# EAGLE design Instrumentation amp (EAGLE 6.6.0)
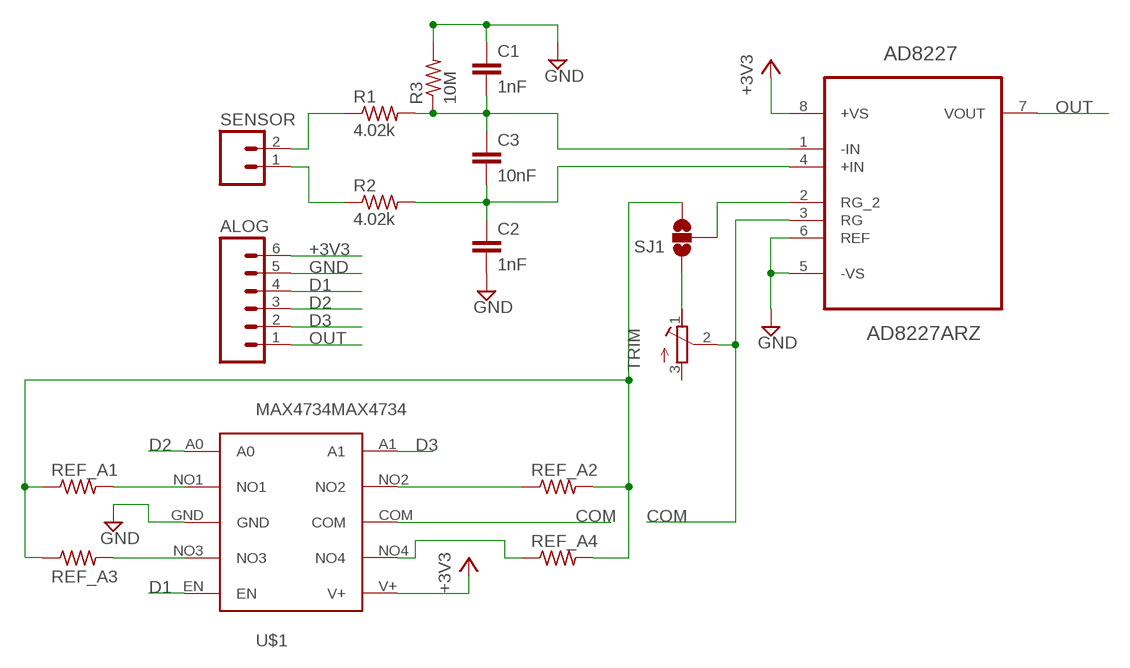
[diagram p0: schematic, sheet 1]

## Parts
AD8227  AD8227ARZ  [SOIC127P600X175-8N]
ALOG  M063.5MM-6  [SCREWTERMINAL-3.5MM-6]
C1  1nF  C-EUC0805  [C0805]
C2  1nF  C-EUC0805  [C0805]
C3  10nF  C-EUC0805  [C0805]
R1  4.02k  R-US_M0805  [M0805]
R2  4.02k  R-US_M0805  [M0805]
R3  10M  R-US_M0805  [M0805]
REF_A1  R-US_0207/10  [0207/10]
REF_A2  R-US_0207/10  [0207/10]
REF_A3  R-US_0207/10  [0207/10]
REF_A4  R-US_0207/10  [0207/10]
SENSOR  M023.5MM  [SCREWTERMINAL-3.5MM-2]
SJ1  SOLDERJUMPER_2WAYS  [SJ_3]
TRIM  R-TRIMM3006P  [RTRIM3006P]
U$1  MAX4734MAX4734  [UMAX-10]

## Nets
+3V3: AD8227.8(+VS) ALOG.6 U$1.V+
COM: AD8227.3(RG) TRIM.2(S) U$1.COM
D1: ALOG.4 U$1.EN
D2: ALOG.3 U$1.A0
D3: ALOG.2 U$1.A1
GND: AD8227.5(-VS) AD8227.6(REF) ALOG.5 C1.1 C2.2 R3.2 U$1.GND
N$1: AD8227.1(-IN) C1.2 C3.1 R1.2 R3.1
N$2: AD8227.4(+IN) C2.1 C3.2 R2.2
N$4: REF_A1.2 U$1.NO1
N$5: REF_A3.2 U$1.NO3
N$6: REF_A2.1 U$1.NO2
N$8: R1.1 SENSOR.2
N$9: REF_A4.1 U$1.NO4
N$10: R2.1 SENSOR.1
N$11: REF_A1.1 REF_A2.2 REF_A3.1 REF_A4.2 SJ1.3
N$12: SJ1.1 TRIM.1(A)
N$13: AD8227.2(RG_2) SJ1.2
OUT: AD8227.7(VOUT) ALOG.1
Unconnected: TRIM.3(E)

## Library data of the parts
AD8227 = Analog_devices_element14_Batch_1:AD8227ARZ: Rail-to-Rail Output Instrumentation Amplifier; MPN: AD8227ARZ; OC_FARNELL: 1827395; OC_NEWARK: 80R8171; PACKAGE: SOIC-8; SUPPLIER: Analog Devices
ALOG = SparkFun-Connectors:M06: Header 6 Standard 6-pin 0.1" header. Use with straight break away headers (SKU : PRT-00116), right angle break away headers (PRT-00553), swiss pins (PRT-00743), machine pins (PRT-00117), and female headers (PRT-00115). Molex polarized connector foot print use with SKU : PRT-08094 with associated crimp pins and housings. NOTES ON THE VARIANTS LOCK and LOCK_LONGPADS... This footprint was designed to help hold the alignment of a through-hole component (i.e. 6-pin header) while soldering it into place. You may notice that each hole has been shifted either up or down by 0.005 of an inch from it's more standard position (which is a perfectly straight line). This slight alteration caused the pins (the squares in the middle) to touch the edges of the holes. Because they are alternating, it causes a "brace" to hold the component in place. 0.005 has proven to be the perfect amount of "off-center" position when using our standard breakaway headers. Although looks a little odd when you look at the bare footprint, once you have a header in there, the alteration is very hard to notice. Also,if you push a header all the way into place, it is covered up entirely on the bottom side. This idea of altering the position of holes to aid alignment will be further integrated into the Sparkfun Library for other footprints. It can help hold any component with 3 or more connection pins.
C1-C3 = rcl:C-EU: CAPACITOR, European symbol
R1-R3 = rcl:R-US_: RESISTOR, American symbol
REF_A1-REF_A4 = resistor:R-US_: RESISTOR, American symbol
SENSOR = SparkFun-Connectors:M02: Standard 2-pin 0.1" header. Use with - straight break away headers ( PRT-00116) - right angle break away headers (PRT-00553) - swiss pins (PRT-00743) - machine pins (PRT-00117) - female headers (PRT-00115) Molex polarized connector foot print use with: PRT-08233 with associated crimp pins and housings. 2.54_SCREWTERM for use with PRT-10571. 3.5mm Screw Terminal footprints for PRT-08084 5mm Screw Terminal footprints for use with PRT-08432; PROD_ID: CONN-08399
SJ1 = SparkFun-Retired:SOLDERJUMPER_2WAY: Solder Jumper 2 way solder jumper
TRIM = resistor:R-TRIMM: Trimm resistor
U$1 = csandell:MAX4734

## Net classes
0 default: width 0.203 mm, drill 0.305 mm

## Board
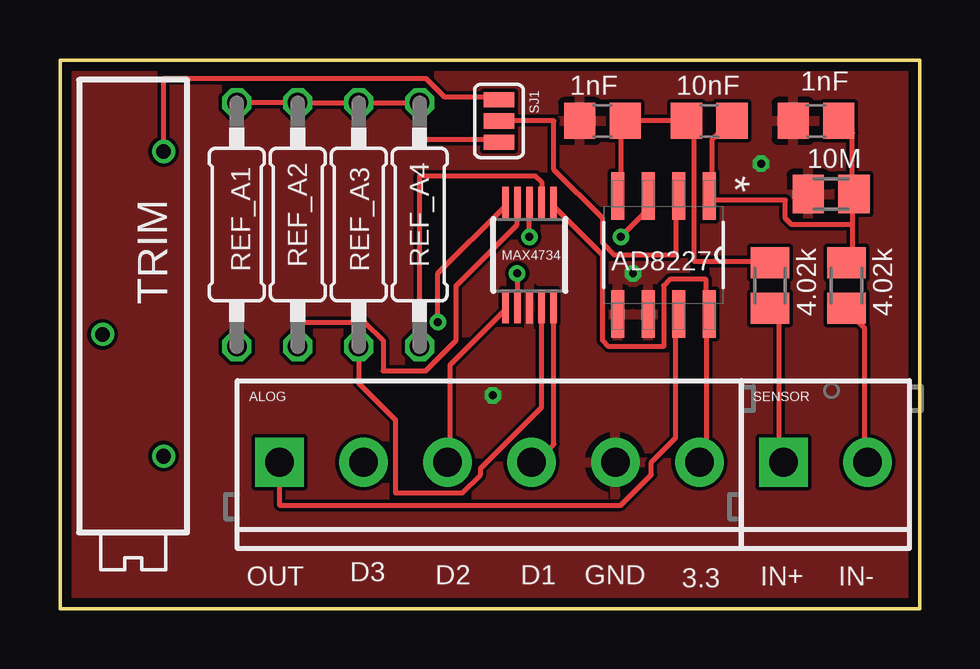
[diagram p1: board, top side]
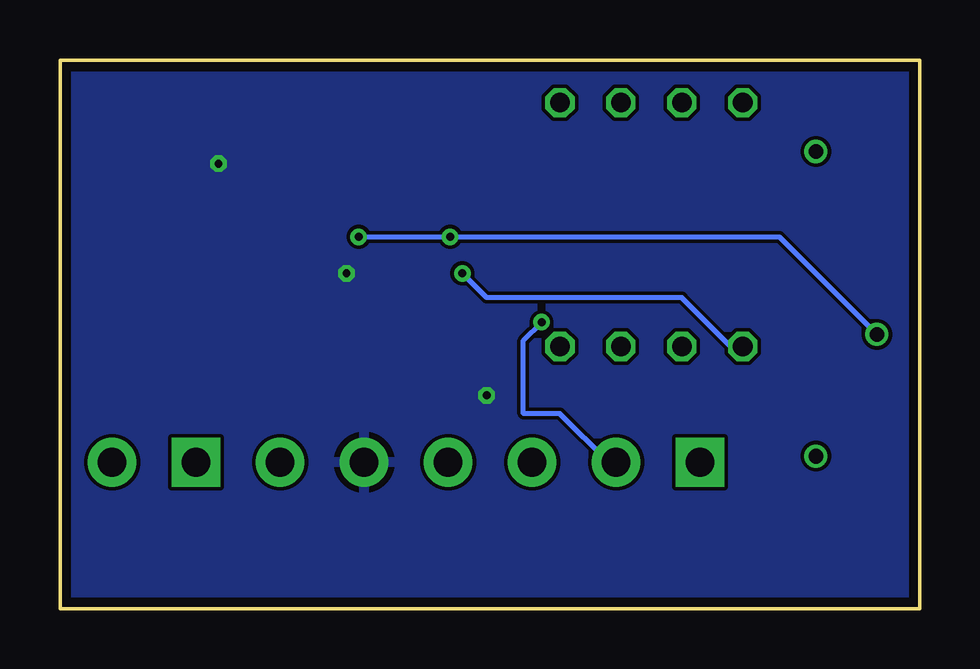
[diagram p2: board, bottom side, seen from below]

Size 35.81 x 22.86 mm. Coordinates in mm from the lower left corner, seen from the top.
Outline: 0,0 35.81,0 35.81,22.86 0,22.86 0,0
Copper layers (1*16): Top 0.0356mm / dielectric 1.5011mm / Bottom 0.0356mm
Design rules "oshpark-2layer": minimum track width 6mil, minimum drill 13mil, track to track 6mil, track to pad 6mil, pad to pad 6mil, via to via 6mil, smd to smd 6mil, copper to edge 15mil, drill to drill 6mil, minimum pad ring 7mil, minimum via ring 7mil, stop-mask expansion 2.5mil, vias tented up to drill 0mil, thermal gap 10mil

### Footprints (pad centres in the part's own frame; a part is rotated, then mirrored left to right if it is on the bottom)
SOIC127P600X175-8N = smd 1.981 x 0.559: 1 -2.464,1.905; 2 -2.464,0.635; 3 -2.464,-0.635; 4 -2.464,-1.905; 5 2.464,-1.905; 6 2.464,-0.635; 7 2.464,0.635; 8 2.464,1.905
SCREWTERMINAL-3.5MM-6 = drill 1.2 pad 2.032 square: 1 0,0 | drill 1.2 pad 2.032: 2 3.5,0; 3 7,0; 4 10.5,0; 5 14,0; 6 17.5,0
C0805 = smd 1.3 x 1.5: 1 -0.95,0; 2 0.95,0
M0805 = smd 1.3 x 1.6: 1 -0.95,0; 2 0.95,0
0207/10 = drill 0.813 octagon: 1 -5.08,0; 2 5.08,0
SCREWTERMINAL-3.5MM-2 = drill 1.2 pad 2.032 square: 1 0,0 | drill 1.2 pad 2.032: 2 3.5,0
SJ_3 = smd 0.635 x 1.27: 1 -0.889,0; 2 0,0; 3 0.889,0
RTRIM3006P = drill 0.61: 1 -7.62,1.27; 2 0,-1.27; 3 5.08,1.27
UMAX-10 = smd 1.4 x 0.28: A0 -2.14,1; A1 2.14,1; COM 2.14,0; EN -2.14,-1; GND -2.14,0; NO1 -2.14,0.5; NO2 2.14,0.5; NO3 -2.14,-0.5; NO4 2.14,-0.5; V+ 2.14,-1

### Placement (x,y rotation side)
AD8227  25.15,14.73 270 top
ALOG  9.14,6.1 0 top
C1  31.5,20.32 0 top
C2  22.61,20.32 180 top
C3  27.05,20.32 180 top
R1  32.77,13.46 90 top
R2  29.59,13.46 90 top
R3  32.13,17.27 180 top
REF_A1  7.37,16 270 top
REF_A2  9.91,16 90 top
REF_A3  12.45,16 270 top
REF_A4  14.99,16 90 top
SENSOR  30.14,6.1 0 top
SJ1  18.29,20.32 270 top
TRIM  3.05,11.43 270 top
U$1  19.56,14.73 90 top

### Tracks (layer width: path | path; a pad name or v marks a point on that pad's centre or on a via)
+3V3
  Top 0.203: U$1.V+ 20.57,16.76 22.61,14.73 22.61,11.18 22.86,10.92 25.15,10.92 25.15,13.46 25.4,13.72 26.92,13.72 26.92,12.45 AD8227.8 26.92,12.19 26.92,6.35 26.67,6.1 ALOG.6
COM  (via drill 0.33)
  Top 0.203: v19.56,15.49 U$1.COM | v23.37,15.49 24.38,16.51 24.38,17.02 AD8227.3
  Bottom 0.203: v23.37,15.49 v19.56,15.49 5.84,15.49 TRIM.2
D1
  Top 0.203: U$1.EN 20.57,12.45 20.57,6.86 19.81,6.1 ALOG.4
D2
  Top 0.203: U$1.A0 18.54,12.45 16.26,10.16 16.26,6.1 ALOG.3
D3  (via drill 0.33)
  Top 0.203: v15.75,11.94 15.75,13.97 18.54,16.76 U$1.A1
  Bottom 0.203: v15.75,11.94 16.51,11.18 16.51,8.13 14.99,8.13 12.95,6.1 ALOG.2
GND  (via drill 0.33)
  Top 0.203: 23.37,12.45 AD8227.5 | 24.38,12.45 AD8227.6
  other vias: 18.03,8.89 29.21,18.54 23.88,13.97
  pour Bottom: 0,22.86 0,0 35.81,0 35.81,22.86
  pour Top: 36.07,23.11 -0.25,23.11 -0.25,-0.25 36.07,-0.25
N$1
  Top 0.203: C3.1 27.94,20.32 27.18,19.56 27.18,17.27 AD8227.1 27.18,17.02 30.23,17.02 30.23,16.26 30.48,16 33.02,16 | 33.02,17.27 33.02,19.81 32.51,20.32 C1.2 | 33.02,17.27 33.02,16 | 33.02,16 33.02,14.73 32.77,14.48 R1.2 | 33.02,17.27 R3.1
N$2
  Top 0.203: R2.2 29.46,14.48 26.42,14.48 26.42,20.07 26.16,20.32 C3.2 C2.1 23.37,20.32 23.37,17.27 AD8227.4
N$4  (via drill 0.33)
  Top 0.203: v19.05,13.97 19.05,12.7 U$1.NO1
  Bottom 0.203: v19.05,13.97 18.03,12.95 9.91,12.95 7.87,10.92 REF_A1.2
N$5
  Top 0.203: REF_A3.2 12.45,9.4 13.97,7.87 13.97,4.83 16.76,4.83 17.53,5.59 17.53,5.84 20.07,8.38 20.07,12.45 U$1.NO3
N$6
  Top 0.203: REF_A2.1 9.91,11.94 12.7,11.94 13.46,11.18 13.46,9.91 15.24,9.91 16.51,11.18 16.51,13.46 19.05,16 19.05,16.76 U$1.NO2
N$8
  Top 0.203: R1.1 32.77,12.45 33.53,11.68 33.53,6.1 SENSOR.2
N$9
  Top 0.203: REF_A4.1 14.99,18.03 19.81,18.03 20.07,17.78 20.07,17.02 U$1.NO4
N$10
  Top 0.203: R2.1 29.72,12.45 29.97,12.19 29.97,6.1 SENSOR.1
N$11
  Top 0.203: SJ1.3 18.29,19.56 14.99,19.56 REF_A4.2 REF_A3.1 REF_A2.2 REF_A1.1
N$12
  Top 0.203: TRIM.1 4.32,22.1 15.24,22.1 16,21.34 18.29,21.34 SJ1.1
N$13
  Top 0.203: SJ1.2 20.57,20.32 20.57,18.29 22.61,16.26 22.61,15.24 23.11,14.73 25.65,14.73 25.65,17.02 AD8227.2
OUT
  Top 0.203: ALOG.1 9.14,4.32 23.37,4.32 24.64,5.59 24.64,6.1 25.65,7.11 25.65,12.19 AD8227.7

### Text on the board
_tsilk: OUT | IN+ | IN- | D3 | D2 | D1 | GND | 3.3